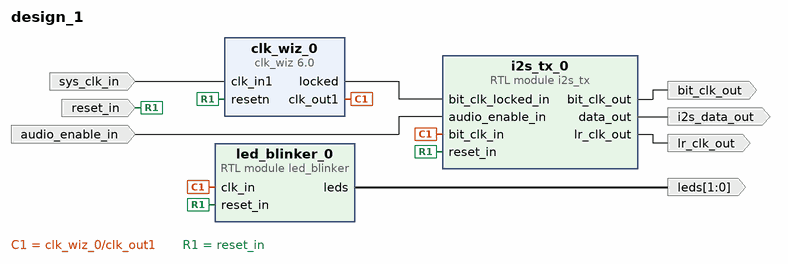
[diagram p0: block diagram of the top level]
# Vivado block design design_1, xc7z010clg400-1, Vivado 2025.2
create_bd_design design_1

create_bd_port -dir I -type clk sys_clk_in
set_property -dict {CONFIG.FREQ_HZ 50000000} [get_bd_ports sys_clk_in]
create_bd_port -dir I -type rst reset_in
set_property -dict {CONFIG.POLARITY ACTIVE_LOW} [get_bd_ports reset_in]
create_bd_port -dir O -from 1 -to 0 leds
create_bd_port -dir O i2s_data_out
create_bd_port -dir O lr_clk_out
create_bd_port -dir O bit_clk_out
create_bd_port -dir I audio_enable_in

create_bd_cell -type module -reference led_blinker led_blinker_0
create_bd_cell -type module -reference i2s_tx i2s_tx_0
create_bd_cell -type ip -vlnv xilinx.com:ip:clk_wiz:6.0 clk_wiz_0
set_property -dict [list \
  CONFIG.CLKIN1_JITTER_PS 200.0 \
  CONFIG.CLKOUT1_DRIVES BUFG \
  CONFIG.CLKOUT1_JITTER 148.402 \
  CONFIG.CLKOUT1_PHASE_ERROR 134.075 \
  CONFIG.CLKOUT1_REQUESTED_OUT_FREQ 24.576 \
  CONFIG.CLKOUT2_DRIVES BUFG \
  CONFIG.CLKOUT3_DRIVES BUFG \
  CONFIG.CLKOUT4_DRIVES BUFG \
  CONFIG.CLKOUT5_DRIVES BUFG \
  CONFIG.CLKOUT6_DRIVES BUFG \
  CONFIG.CLKOUT7_DRIVES BUFG \
  CONFIG.JITTER_SEL Min_O_Jitter \
  CONFIG.MMCM_BANDWIDTH HIGH \
  CONFIG.MMCM_CLKFBOUT_MULT_F 29 \
  CONFIG.MMCM_CLKIN1_PERIOD 20.000 \
  CONFIG.MMCM_CLKIN2_PERIOD 10.0 \
  CONFIG.MMCM_CLKOUT0_DIVIDE_F 59 \
  CONFIG.MMCM_COMPENSATION ZHOLD \
  CONFIG.PLL_CLKIN_PERIOD 20.000 \
  CONFIG.PRIMITIVE PLL \
  CONFIG.PRIM_IN_FREQ 50.000 \
  CONFIG.RESET_PORT resetn \
  CONFIG.RESET_TYPE ACTIVE_LOW \
] [get_bd_cells clk_wiz_0]

# ---- connections ----

connect_bd_net -net audio_enable_in_0_1 [get_bd_ports audio_enable_in] [get_bd_pins i2s_tx_0/audio_enable_in]
connect_bd_net -net clk_in1_0_1 [get_bd_ports sys_clk_in] [get_bd_pins clk_wiz_0/clk_in1]
connect_bd_net [get_bd_pins clk_wiz_0/clk_out1] [get_bd_pins led_blinker_0/clk_in] [get_bd_pins i2s_tx_0/bit_clk_in]
connect_bd_net [get_bd_pins clk_wiz_0/locked] [get_bd_pins i2s_tx_0/bit_clk_locked_in]
connect_bd_net [get_bd_pins i2s_tx_0/bit_clk_out] [get_bd_ports bit_clk_out]
connect_bd_net [get_bd_pins i2s_tx_0/data_out] [get_bd_ports i2s_data_out]
connect_bd_net [get_bd_pins i2s_tx_0/lr_clk_out] [get_bd_ports lr_clk_out]
connect_bd_net [get_bd_pins led_blinker_0/leds] [get_bd_ports leds]
connect_bd_net -net reset_0_1 [get_bd_ports reset_in] \
  [get_bd_pins led_blinker_0/reset_in] [get_bd_pins clk_wiz_0/resetn] [get_bd_pins i2s_tx_0/reset_in]

validate_bd_design
save_bd_design
